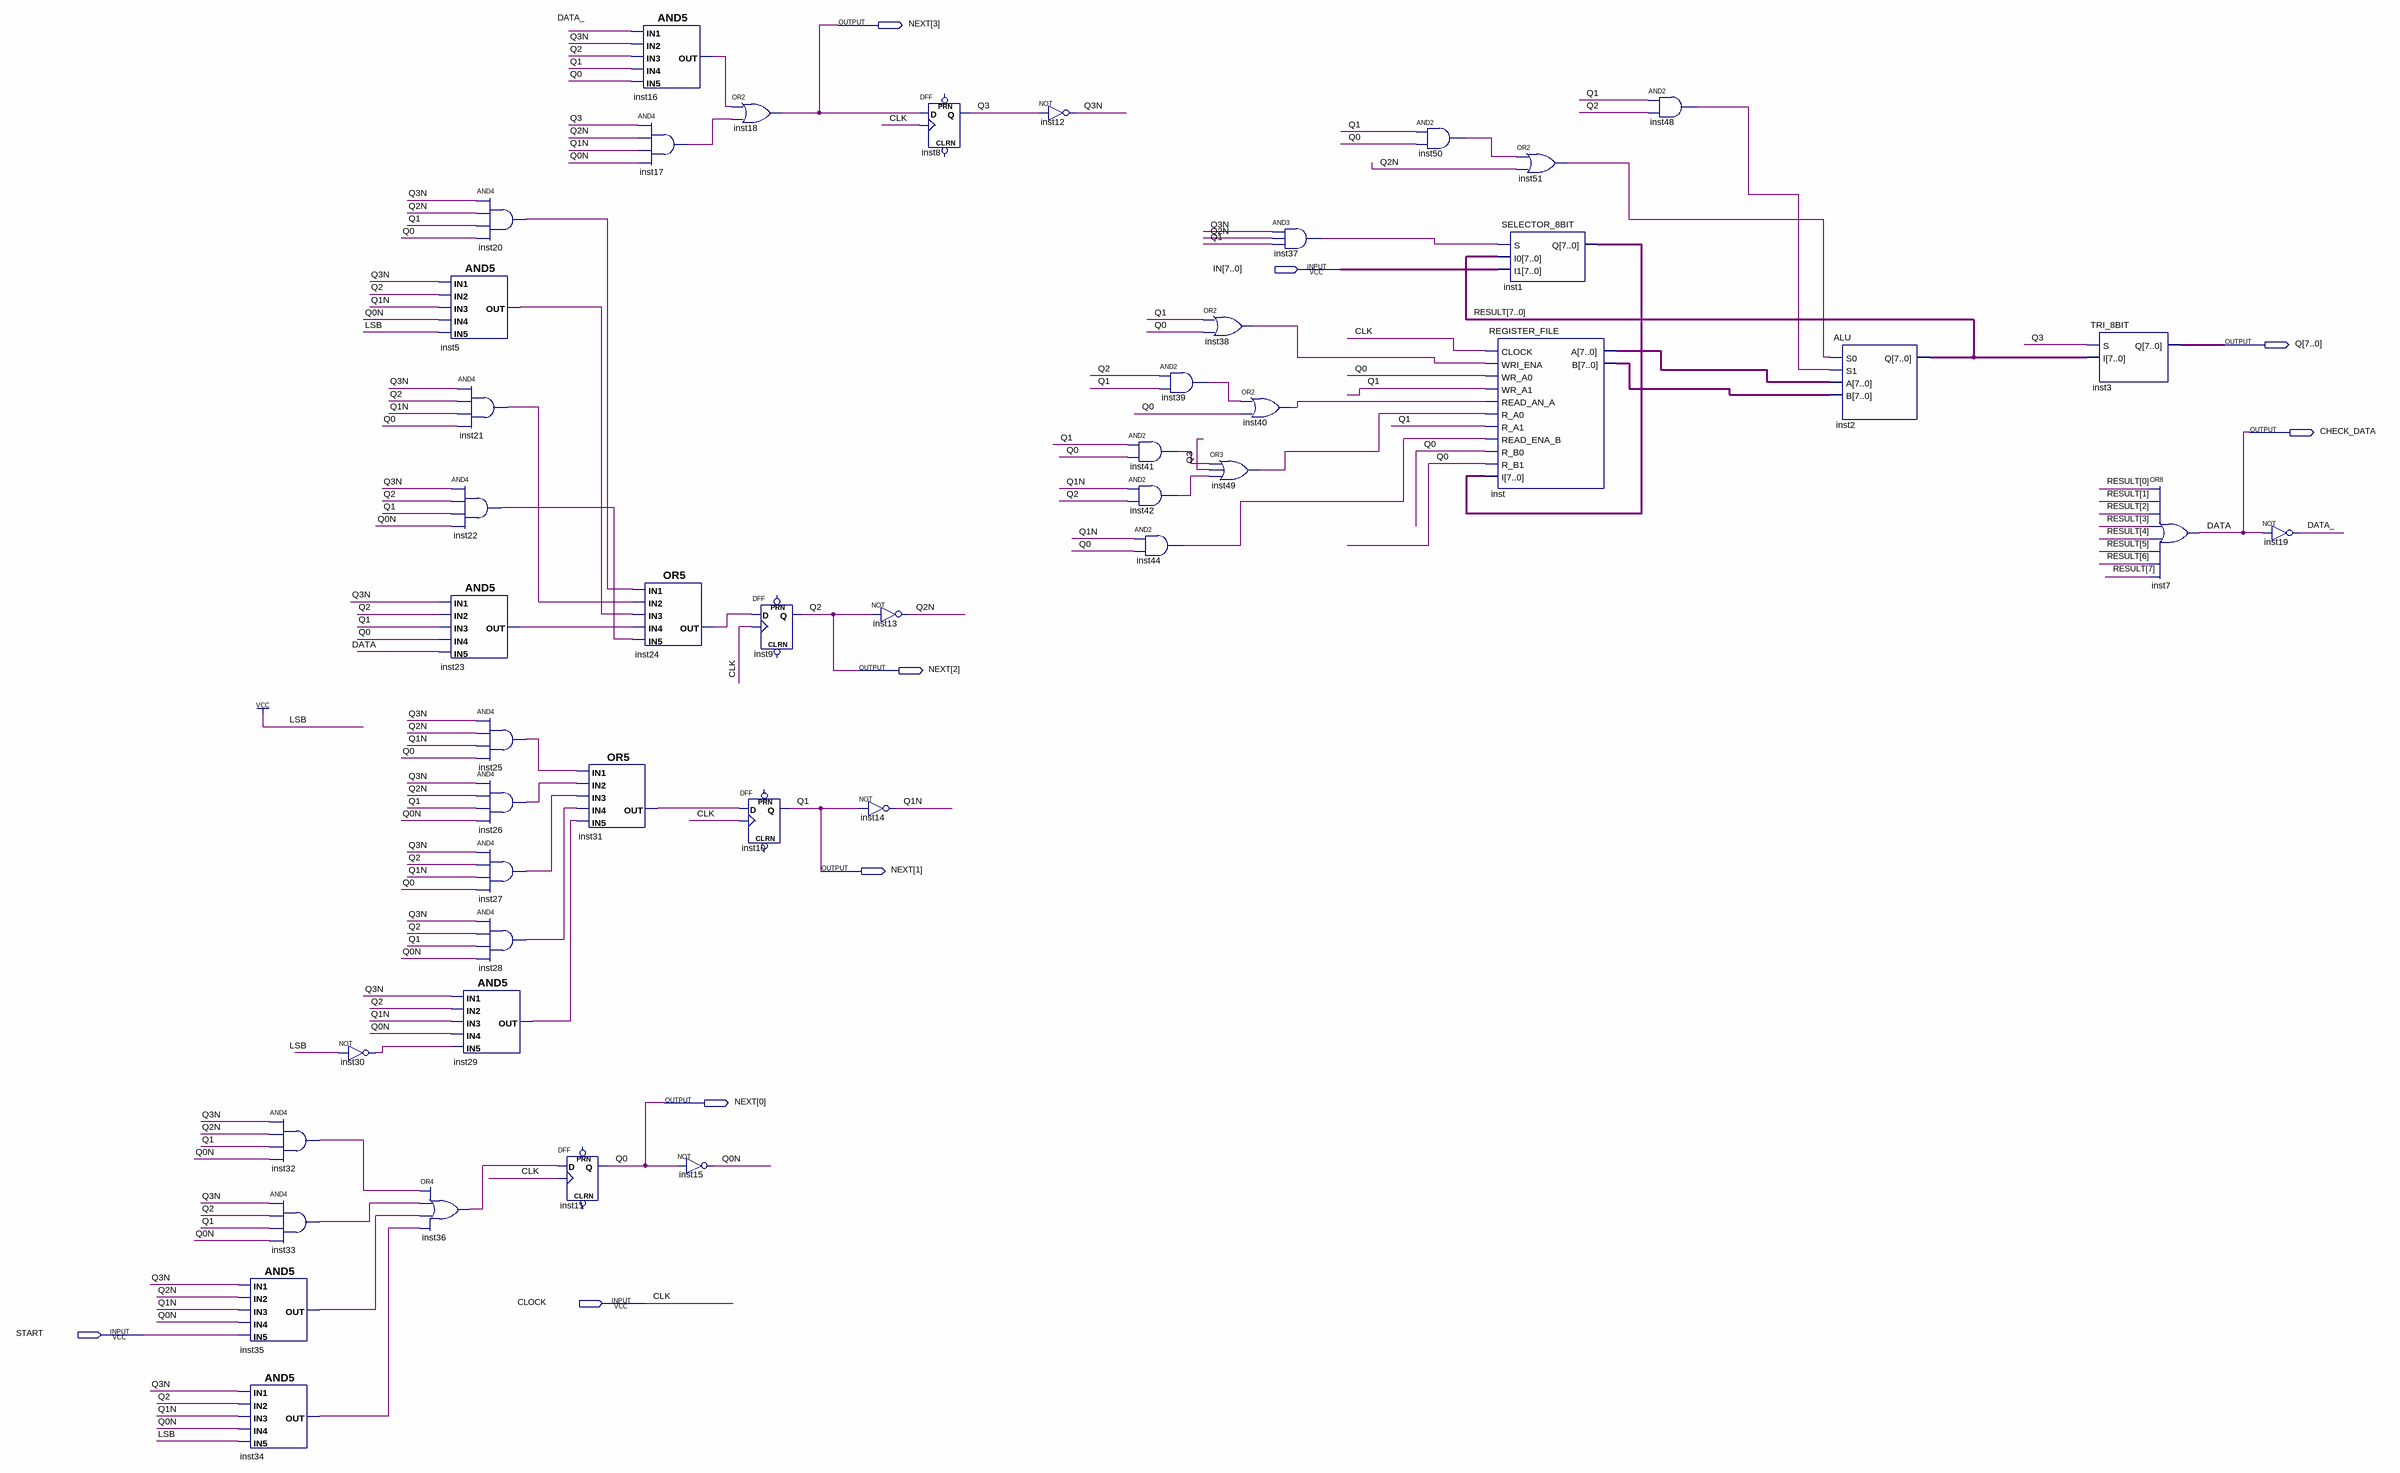
[diagram p0: schematic sheet]
// Quartus schematic SHIFTER.bdf as structural Verilog: 46 symbols, 9 pins
module SHIFTER (
  input  [7:0] IN,
  input  CLOCK,
  input  START,
  output [3:0] NEXT,
  output [7:0] Q,
  output CHECK_DATA
);

  wire DATA_, inst5_out, inst16_out, inst17_out, inst20_out, inst21_out, inst22_out, inst23_out, inst24_out,
       inst25_out, inst26_out, inst27_out, inst28_out, inst29_out, inst30_out, inst31_out, inst32_out,
       inst33_out, inst34_out, inst35_out, inst36_out, inst37_out, inst38_out, inst39_out, inst40_out,
       inst41_out, inst42_out, inst44_out, inst48_out, inst49_out, inst50_out, inst51_out, Q0N, Q1N, Q2N, Q3N;
  wire [7:0] inst1_q, inst_a, inst_b, RESULT;

  and inst32 (inst32_out, Q3N, Q2N, NEXT[1], Q0N);
  and inst33 (inst33_out, Q3N, NEXT[2], NEXT[1], Q0N);
  and inst35 (inst35_out, Q3N, Q2N, Q1N, Q0N, START);
  and inst34 (inst34_out, Q3N, NEXT[2], Q1N, Q0N, 1'b1);
  not inst30 (inst30_out, 1'b1);
  or inst36 (inst36_out, inst32_out, inst33_out, inst35_out, inst34_out);
  and inst20 (inst20_out, Q3N, Q2N, NEXT[1], NEXT[0]);
  and inst5 (inst5_out, Q3N, NEXT[2], Q1N, Q0N, 1'b1);
  and inst21 (inst21_out, Q3N, NEXT[2], Q1N, NEXT[0]);
  and inst22 (inst22_out, Q3N, NEXT[2], NEXT[1], Q0N);
  and inst23 (inst23_out, Q3N, NEXT[2], NEXT[1], NEXT[0], CHECK_DATA);
  and inst25 (inst25_out, Q3N, Q2N, Q1N, NEXT[0]);
  and inst26 (inst26_out, Q3N, Q2N, NEXT[1], Q0N);
  and inst27 (inst27_out, Q3N, NEXT[2], Q1N, NEXT[0]);
  and inst28 (inst28_out, Q3N, NEXT[2], NEXT[1], Q0N);
  and inst29 (inst29_out, Q3N, NEXT[2], Q1N, Q0N, inst30_out);
  or inst31 (inst31_out, inst25_out, inst26_out, inst27_out, inst28_out, inst29_out);
  DFF inst11 (.CLK(CLOCK), .D(inst36_out), .Q(NEXT[0]));  // open: CLRN, PRN
  and inst16 (inst16_out, DATA_, Q3N, NEXT[2], NEXT[1], NEXT[0]);
  and inst17 (inst17_out, Q[3], Q2N, Q1N, Q0N);
  or inst24 (inst24_out, inst20_out, inst21_out, inst5_out, inst23_out, inst22_out);
  not inst15 (Q0N, NEXT[0]);
  or inst18 (NEXT[3], inst16_out, inst17_out);
  DFF inst9 (.CLK(CLOCK), .D(inst24_out), .Q(NEXT[2]));  // open: CLRN, PRN
  DFF inst10 (.CLK(CLOCK), .D(inst31_out), .Q(NEXT[1]));  // open: CLRN, PRN
  not inst13 (Q2N, NEXT[2]);
  not inst14 (Q1N, NEXT[1]);
  DFF inst8 (.CLK(CLOCK), .D(NEXT[3]), .Q(Q[3]));  // open: CLRN, PRN
  not inst12 (Q3N, Q[3]);
  and inst41 (inst41_out, NEXT[1], NEXT[0]);
  and inst42 (inst42_out, Q1N, NEXT[2]);
  and inst44 (inst44_out, Q1N, NEXT[0]);
  and inst39 (inst39_out, NEXT[2], NEXT[1]);
  or inst38 (inst38_out, NEXT[1], NEXT[0]);
  or inst49 (inst49_out, inst41_out, Q[3], inst42_out);
  and inst37 (inst37_out, Q3N, Q2N, NEXT[1]);
  or inst40 (inst40_out, inst39_out, NEXT[0]);
  and inst50 (inst50_out, NEXT[1], NEXT[0]);
  REGISTER_FILE inst (
    .CLOCK(CLOCK), .WRI_ENA(inst38_out), .WR_A0(NEXT[0]), .WR_A1(NEXT[1]), .READ_AN_A(inst40_out),
    .R_A0(inst49_out), .R_A1(NEXT[1]), .READ_ENA_B(inst44_out), .R_B0(NEXT[0]), .R_B1(NEXT[0]), .I(inst1_q),
    .A(inst_a), .B(inst_b));
  or inst51 (inst51_out, inst50_out, Q2N);
  SELECTOR_8BIT inst1 (.S(inst37_out), .I0(RESULT), .I1(IN), .Q(inst1_q));
  and inst48 (inst48_out, NEXT[1], NEXT[2]);
  ALU inst2 (.S0(inst51_out), .S1(inst48_out), .A(inst_a), .B(inst_b), .Q(RESULT));
  TRI_8BIT inst3 (.S(Q[3]), .I(RESULT), .Q({Q[7:3], NEXT[2:0]}));
  or inst7 (CHECK_DATA, RESULT[0], RESULT[1], RESULT[2], RESULT[3], RESULT[4], RESULT[5], RESULT[6], RESULT[7]);
  not inst19 (DATA_, CHECK_DATA);

  assign Q[2:0] = NEXT[2:0];

  // Other names for the same wires on the sheet: CLK = CLOCK; DATA = CHECK_DATA; Q0 = NEXT[0]; Q1 = NEXT[1];
  //   Q2 = NEXT[2]
endmodule
